# Altium schematic sheet vio-buffer.SchDoc
size Letter; CompanyName: Brinton Engineering, LLC; Address1: 3479 Edison Way; Address2: Menlo Park CA 94025; Address3: +1 (877) 778-8435; Address4: brintonengineering.com; Revision: 1; SheetNumber: 38; SheetTotal: 39
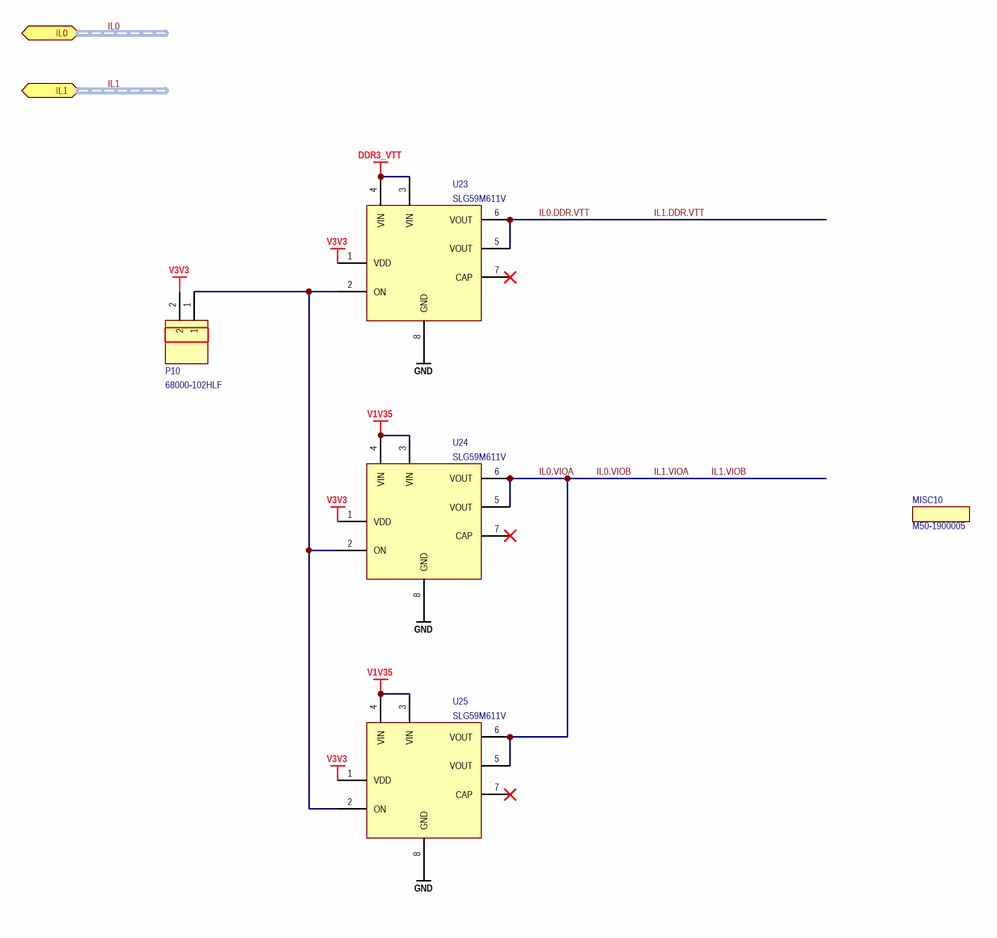
[diagram p0: vio-buffer.SchDoc]

## Parts
MISC10  M50-1900005  (mechanical)
P10  68000-102HLF  [68000-102HLF]
U23  SLG59M611V  [SLG59M611V]
U24  SLG59M611V  [SLG59M611V]
U25  SLG59M611V  [SLG59M611V]

## Ports
IL0 (harness IL-1V35), IL1 (harness IL-1V35)

## Nets
DDR3_VTT: U23.3(VIN) U23.4(VIN)
GND: U23.8(GND) U24.8(GND) U25.8(GND)
V1V35: U24.3(VIN) U24.4(VIN) U25.3(VIN) U25.4(VIN)
V3V3: P10.2 U23.1(VDD) U24.1(VDD) U25.1(VDD)
IL0.DDR.VTT: U23.5(VOUT) U23.6(VOUT)  [also labelled IL1.DDR.VTT]
IL0.VIOA: U24.5(VOUT) U24.6(VOUT) U25.5(VOUT) U25.6(VOUT)  [also labelled IL0.VIOB, IL1.VIOA, IL1.VIOB]
NetP10_1: P10.1 U23.2(ON) U24.2(ON) U25.2(ON)

Not connected (* = marked no-connect by the designer): U23 7(CAP)*; U24 7(CAP)*; U25 7(CAP)*

## Buses and harness runs
harness IL0 = port IL0
harness IL1 = port IL1

## Notes on the sheet
- Title
- Engineer
- Revision
- Drawn By
- Checked By
- Date
- Sheet
- of

## Library data of the parts
MISC10 = M50-1900005: 1.27mm Jumper Socket; Manufacturer: Harwin; Manufacturer P/N: M50-1900005
P10 = 68000-102HLF: Connector; Header; 2 Position; 0.1" Pitch; Manufacturer: FCI; Manufacturer P/N: 68000-102HLF
U23-U25 = SLG59M611V: Ultra-small 4.0A Load Switch with Reverse Current Blocking; Manufacturer: Silego; Manufacturer P/N: SLG59M611V